# EAGLE design MegaMini (EAGLE 8.4.1)
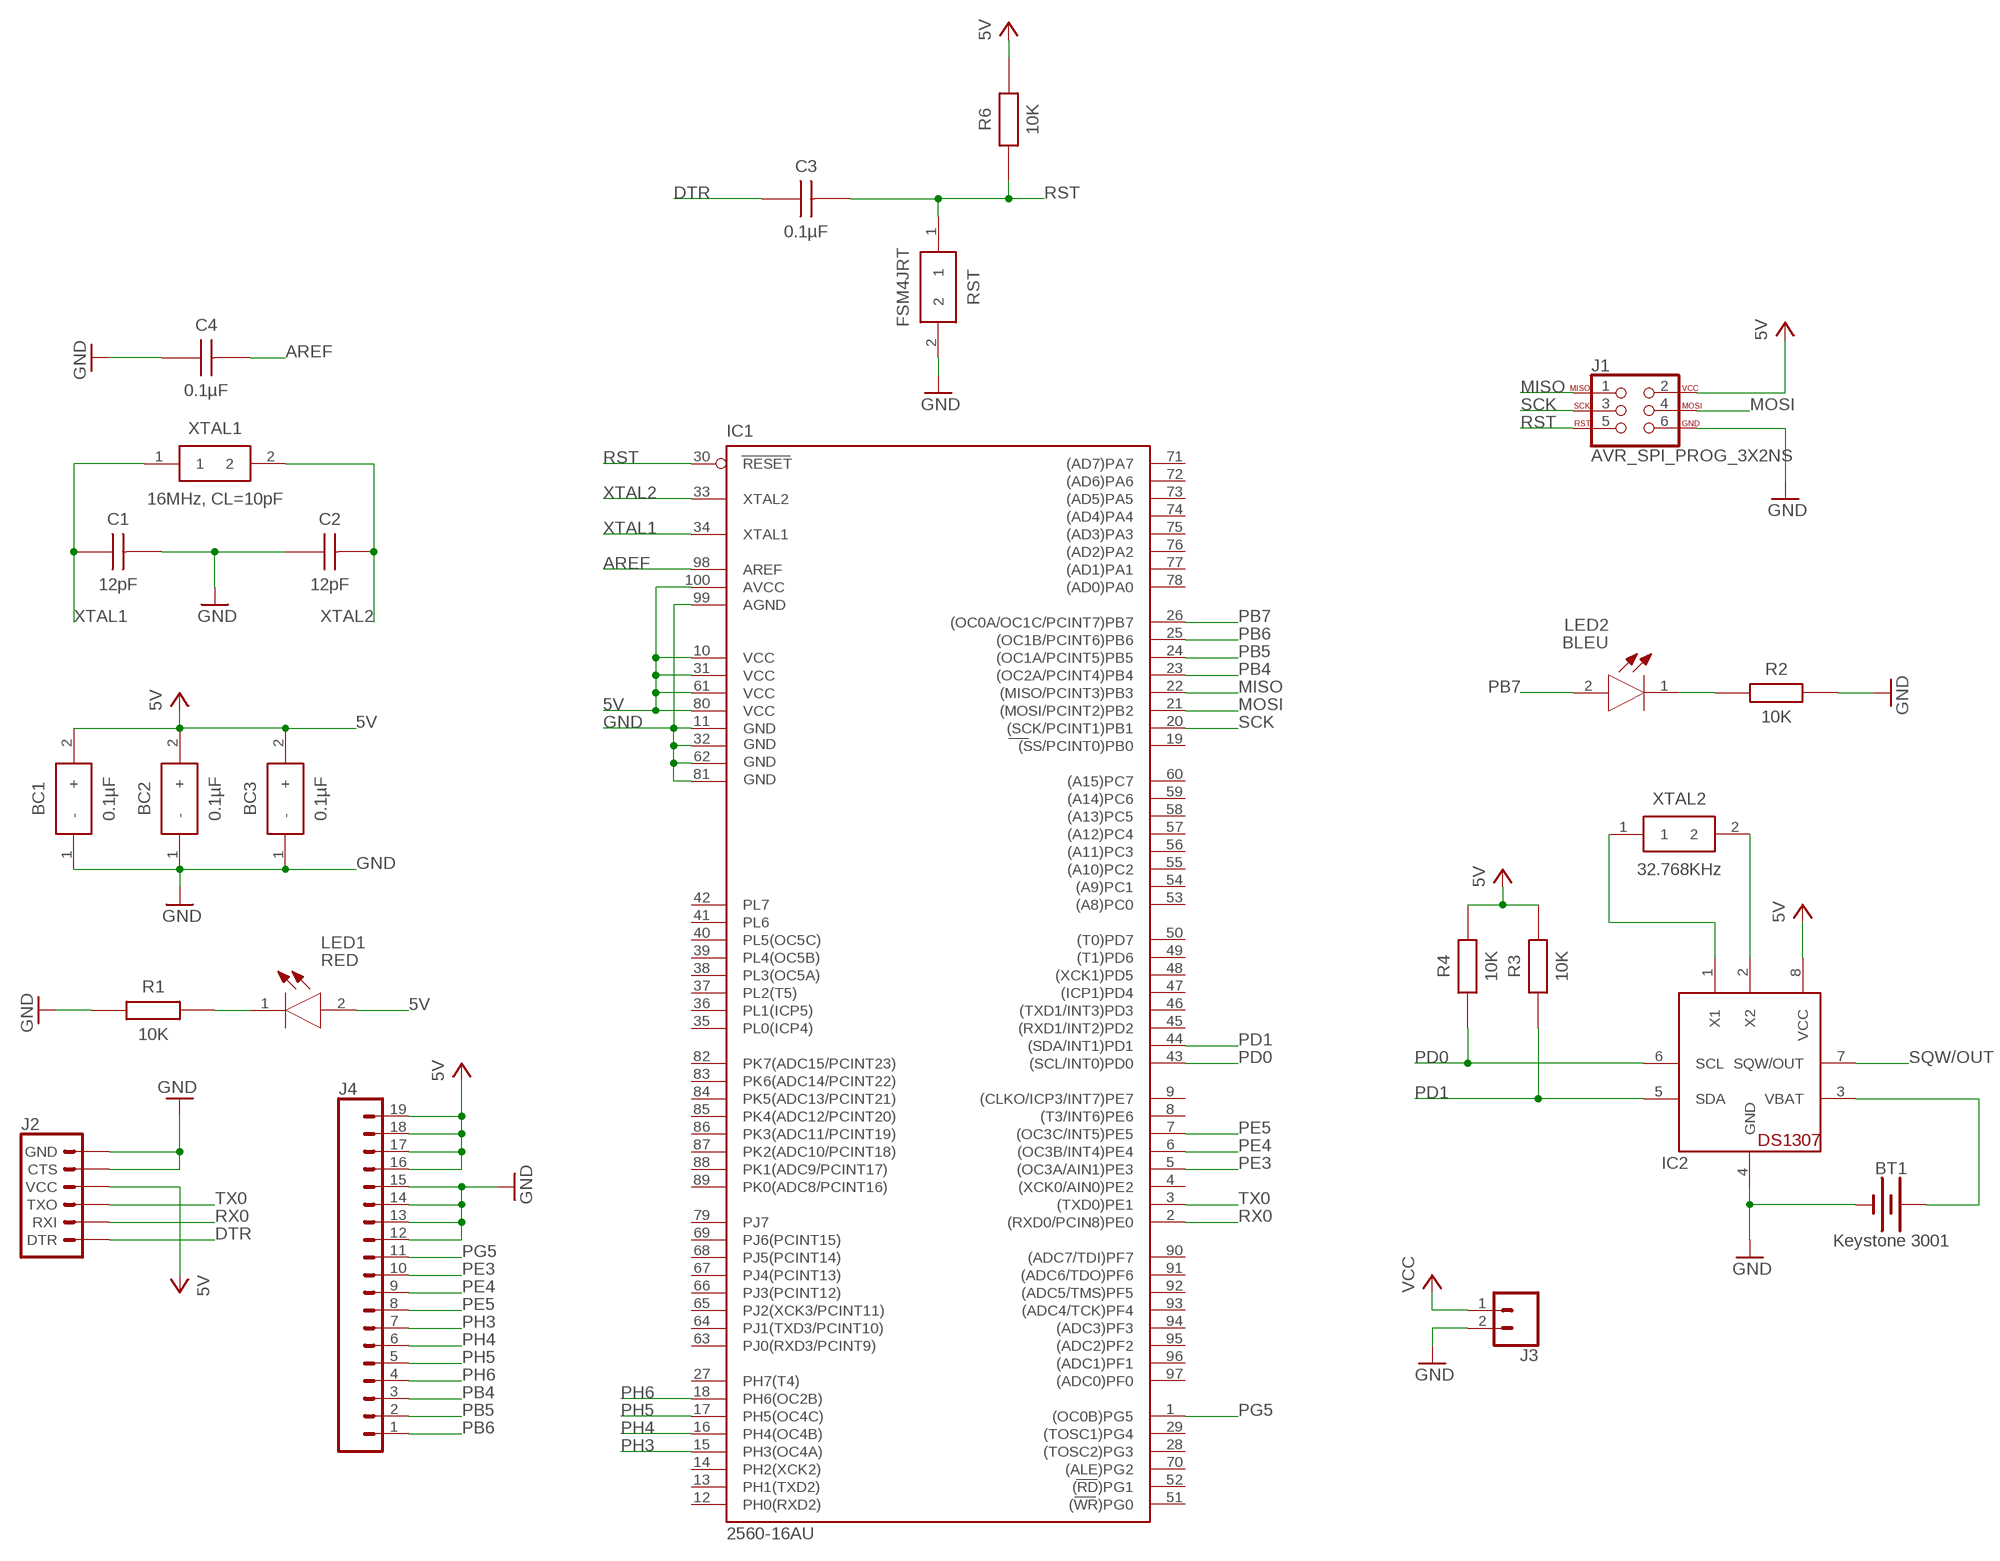
[diagram p0: schematic, sheet 1]

## Parts
BC1  0.1µF  865230640001  [865230640001]
BC2  0.1µF  865230640001  [865230640001]
BC3  0.1µF  865230640001  [865230640001]
BT1  Keystone 3001  BATTERY-12MM_PTH  [BATTCON_12MM_PTH]
C1  12pF  C1206C120J5GACTU  [CAPC3216X88N]
C2  12pF  C1206C120J5GACTU  [CAPC3216X88N]
C3  0.1µF  MC1206B104K500CT  [CAPC3216X90N]
C4  0.1µF  MC1206B104K500CT  [CAPC3216X90N]
IC1  2560-16AU  ATMEGA2560-16AU  [TQFP100]
IC2  DS1307  [DIL08]
J1  AVR_SPI_PROG_3X2NS  [2X3-NS]
J2  6_PIN_SERIAL_TARGET  [1X06]
J3  CONN_02  [1X02]
J4  CONN_19  [1X19]
LED1  RED  150060RS75000  [LEDC1608X80N]
LED2  BLEU  150120BS75000  [LEDC3214X78N]
R1  10K  ERJ-8ENF1002V  [RESC3116X70N]
R2  10K  ERJ-8ENF1002V  [RESC3116X70N]
R3  10K  ERJ-8ENF1002V  [RESC3116X70N]
R4  10K  ERJ-8ENF1002V  [RESC3116X70N]
R6  10K  ERJ-8ENF1002V  [RESC3116X70N]
RST  FSM4JRT  [FSM4JRT]
XTAL1  16MHz, CL=10pF  FOXSDLF_160-20  [FOXSDLF/120-20]
XTAL2  32.768KHz  Q13FC13500004_FC-135_32.768KHZ  [FC-135]

## Nets
5V: BC1.2(+) BC2.2(+) BC3.2(+) IC1.10(VCC) IC1.31(VCC1) IC1.61(VCC2) IC1.80(VCC3) IC1.100(AVCC) LED1.2(A)
AREF: C4.2 IC1.98(AREF)
DTR: C3.1 J2.1(DTR)
GND: BC1.1(-) BC2.1(-) BC3.1(-) BT1.GND(-) C1.2 C2.1 C4.1 IC1.11(GND) IC1.32(GND1) IC1.62(GND2) IC1.81(GND3) IC1.99(AGND) IC2.4(GND) J1.6 J2.5(CTS) J2.6(GND) J3.2 J4.12 J4.13 J4.14 J4.15 R1.1 R2.1 RST.2
MISO: IC1.22((MISO/PCINT3)PB3) J1.1
MOSI: IC1.21((MOSI/PCINT2)PB2) J1.4
N$1: LED1.1(K) R1.2
N$2: LED2.1(K) R2.2
N$3: IC2.1(X1) XTAL2.1
N$4: IC2.2(X2) XTAL2.2
N$5: BT1.VCC@1(+) IC2.3(VBAT)
PB4: IC1.23((OC2A/PCINT4)PB4) J4.3
PB5: IC1.24((OC1A/PCINT5)PB5) J4.2
PB6: IC1.25((OC1B/PCINT6)PB6) J4.1
PB7: IC1.26((OC0A/OC1C/PCINT7)PB7) LED2.2(A)
PD0: IC1.43((SCL/INT0)PD0) IC2.6(SCL) R4.1
PD1: IC1.44((SDA/INT1)PD1) IC2.5(SDA) R3.1
PE3: IC1.5((OC3A/AIN1)PE3) J4.10
PE4: IC1.6((OC3B/INT4)PE4) J4.9
PE5: IC1.7((OC3C/INT5)PE5) J4.8
PG5: IC1.1((OC0B)PG5) J4.11
PH3: IC1.15(PH3(OC4A)) J4.7
PH4: IC1.16(PH4(OC4B)) J4.6
PH5: IC1.17(PH5(OC4C)) J4.5
PH6: IC1.18(PH6(OC2B)) J4.4
RST: C3.2 IC1.30(RESET) J1.5 R6.1 RST.1
RX0: IC1.2((RXD0/PCIN8)PE0) J2.2(RXI)
SCK: IC1.20((SCK/PCINT1)PB1) J1.3
SQW/OUT: IC2.7(SQW/OUT)
TX0: IC1.3((TXD0)PE1) J2.3(TXO)
VCC: IC2.8(VCC) J1.2 J2.4(VCC) J3.1 J4.16 J4.17 J4.18 J4.19 R3.2 R4.2 R6.2 ; supply symbol labelled 5V
XTAL1: C1.1 IC1.34(XTAL1) XTAL1.1
XTAL2: C2.2 IC1.33(XTAL2) XTAL1.2
Unconnected: IC1.4((XCK0/AIN0)PE2) IC1.8((T3/INT6)PE6) IC1.9((CLKO/ICP3/INT7)PE7) IC1.12(PH0(RXD2)) IC1.13(PH1(TXD2)) IC1.14(PH2(XCK2)) IC1.19((SS/PCINT0)PB0) IC1.27(PH7(T4)) IC1.28((TOSC2)PG3) IC1.29((TOSC1)PG4) IC1.35(PL0(ICP4)) IC1.36(PL1(ICP5)) IC1.37(PL2(T5)) IC1.38(PL3(OC5A)) IC1.39(PL4(OC5B)) IC1.40(PL5(OC5C)) IC1.41(PL6) IC1.42(PL7) IC1.45((RXD1/INT2)PD2) IC1.46((TXD1/INT3)PD3) IC1.47((ICP1)PD4) IC1.48((XCK1)PD5) IC1.49((T1)PD6) IC1.50((T0)PD7) IC1.51((WR)PG0) IC1.52((RD)PG1) IC1.53((A8)PC0) IC1.54((A9)PC1) IC1.55((A10)PC2) IC1.56((A11)PC3) IC1.57((A12)PC4) IC1.58((A13)PC5) IC1.59((A14)PC6) IC1.60((A15)PC7) IC1.63(PJ0(RXD3/PCINT9)) IC1.64(PJ1(TXD3/PCINT10)) IC1.65(PJ2(XCK3/PCINT11)) IC1.66(PJ3(PCINT12)) IC1.67(PJ4(PCINT13)) IC1.68(PJ5(PCINT14)) IC1.69(PJ6(PCINT15)) IC1.70((ALE)PG2) IC1.71((AD7)PA7) IC1.72((AD6)PA6) IC1.73((AD5)PA5) IC1.74((AD4)PA4) IC1.75((AD3)PA3) IC1.76((AD2)PA2) IC1.77((AD1)PA1) IC1.78((AD0)PA0) IC1.79(PJ7) IC1.82(PK7(ADC15/PCINT23)) IC1.83(PK6(ADC14/PCINT22)) IC1.84(PK5(ADC13/PCINT21)) IC1.85(PK4(ADC12/PCINT20)) IC1.86(PK3(ADC11/PCINT19)) IC1.87(PK2(ADC10/PCINT18)) IC1.88(PK1(ADC9/PCINT17)) IC1.89(PK0(ADC8/PCINT16)) IC1.90((ADC7/TDI)PF7) IC1.91((ADC6/TDO)PF6) IC1.92((ADC5/TMS)PF5) IC1.93((ADC4/TCK)PF4) IC1.94((ADC3)PF3) IC1.95((ADC2)PF2) IC1.96((ADC1)PF1) IC1.97((ADC0)PF0)

## Library data of the parts
BC1-BC3 = C_WCAP-AS5H Series:865230640001: Wurth Elektronik 100nF 50 V dc Aluminium Electrolytic Capacitor, WCAP-AS5H Series 5000h 5.5 (Dia.) x 3.85mm <https://componentsearchengine.com/Images/3/865230640001.jpg> Source: Datasheet <http://uk.rs-online.com/webdocs/135a/0900766b8135a640.pdf>; DESCRIPTION: Wurth Elektronik 100nF 50 V dc Aluminium Electrolytic Capacitor, WCAP-AS5H Series 5000h 5.5 (Dia.) x 3.85mm; HEIGHT: mm; MANUFACTURER_NAME: W&uuml;rth Elektronik; MANUFACTURER_PART_NUMBER: 865230640001; RS_PART_NUMBER: 8387838P; SUPPLIER_NAME: RS
BT1 = SparkFun-Batteries:BATTERY: Battery - Single Cell A variety of battery chemistries, sizes, and footprints. Device List: 20MM_PTH - Coin Cell Battery Holder - 20mm (PTH) <https://www.sparkfun.com/products/783> 6.8MM_PTH - Coin Cell Battery Holder - 6.8MM(SMD) <https://www.digikey.com/product-detail/en/seiko-instruments/MS621FE-FL11E/728-1057-ND/1889208?WT.srch=1&gclid=CNOQ5a6LzdQCFZS2wAodXCkE0g> 12MM_SMD - Coin Cell Battery Holder - 12mm (SMD) <https://www.sparkfun.com/products/10592> 12MM_PTH - Coin Cell Battery Holder - 12mm (PTH) <https://www.sparkfun.com/products/7948> 20MM_SMD - 20mm Coin Cell Battery Holder (SMD) (2 legs) Used on the Big Time Watch Kit <https://www.sparkfun.com/products/11734> 20MM_SMD_4LEGS - Coin Cell Battery Holder - 20mm (SMD) <https://www.sparkfun.com/products/11892> 20MM_SMD_4LEGS_OVERPASTE - Coin Cell Battery Holder - 20mm (SMD) <https://www.sparkfun.com/products/11892> (Over-paste on the legs) 24.5MM_PTH - Coin Cell Battery Holder - 24.5mm (PTH) <https://www.sparkfun.com/products/8863> 9V - 9V Battery Holder - PC Mount Used on the SparkFun SparkPunk Sound Kit <https://www.sparkfun.com/products/11177> and SparkFun SparkPunk Sequencer Kit <https://www.sparkfun.com/products/12707> 18650 - Battery Holder - 18650 (PTH) <https://www.sparkfun.com/products/13113> AA - Battery Holder - 1xAA (PTH) <https://www.sparkfun.com/products/7949> AAA - Battery Holder - 1xAAA (PTH) <https://www.sparkfun.com/products/12718> AA_KIT - Battery Holder - 1xAA (PTH) <https://www.sparkfun.com/products/7949> Special kit package - pads only have exposed copper on one side of the board. AAA_KIT - Battery Holder - 1xAAA (PTH) <https://www.sparkfun.com/products/12718> Special kit package - pads only have exposed copper on one side of the board.; PROD_ID: BATT-08315; SF_SKU: PRT-07948
C1 C2 = C_C1206C120J5GACTU:C1206C120J5GACTU: Kemet 1206 C 12pF Ceramic Multilayer Capacitor, 50 V, +125C, C0G Dielectric, 5% <https://componentsearchengine.com/Images/3/C1206C120J5GACTU.jpg> Source: Datasheet <http://uk.rs-online.com/webdocs/1526/0900766b81526086.pdf>; DESCRIPTION: Kemet 1206 C 12pF Ceramic Multilayer Capacitor, 50 V, +125C, C0G Dielectric, 5%; HEIGHT: 0.88mm; MANUFACTURER_NAME: Kemet; MANUFACTURER_PART_NUMBER: C1206C120J5GACTU; RS_PART_NUMBER: 8029986P; SUPPLIER_NAME: RS
C3 C4 = C_MC1206B104K500CT:MC1206B104K500CT: MULTICOMP - MC1206B104K500CT - CAP, MLCC, X7R, 100NF, 50V, 1206 Source: Datasheet <http://www.farnell.com/datasheets/1901289.pdf>; DESCRIPTION: MULTICOMP - MC1206B104K500CT - CAP, MLCC, X7R, 100NF, 50V, 1206; HEIGHT: 0.9mm; MANUFACTURER_NAME: MULTICOMP; MANUFACTURER_PART_NUMBER: MC1206B104K500CT; SUPPLIER_NAME: RS
IC1 = atmel-2005:ATMEGA*: MICROCONTROLLER 64/128/256 Kbytes FLASH 4 Kbytes EEPROM 8 Kbytes SRAM 86 General Purpose I/O pins 12-channels16-bit PWM 4 x Serial USARTs 16-channels 10-bit A/D
IC2 = adafruit:DS1307: DS1307 Real time clock (RTC) with battery backup ability. Talk to it via i2c
J1 = SparkFun-Connectors:AVR_SPI_PROG_3X2: AVR ISP 6 Pin This is the reduced ISP connector for AVR programming. Common on Arduino. This footprint will take up less PCB space and can be used with a 10-pin to 6-pin adapter such as SKU: BOB-08508 **Special note about "TEST_POINT" package. The stop mask is on the top side, so if you want your programming test points to be on the bottom of your board, make sure to place this package on the bottom side of the board. This also ensure that the orientation to program from the bottom side will be correct. SparkFun Products: SparkFun ISP Pogo Adapter <https://www.sparkfun.com/products/11591> - NS Tiny AVR Programmer <https://www.sparkfun.com/products/11801> -PTH
J2 = SparkFun-Connectors:6_PIN_SERIAL_TARGET: 6-pin header connection for use with the "FTDI BASIC" pinout - TARGET SIDE. Also known as "Arduino Serial Program Header". It is used to mate with our FTDI Basic serial programmers using the Arduino IDE. Note, this device has "TARGET" in the name. It is intended to be used on a design that contains a target micro-controller that you wish to program. The "sister" device, named "CABLE" is inteneded to be used on a design that usually lives on the end of your USB cable and prvides the converter chip (FTDI232 or FTDI231x) to commnicate serial RX/TX. You can populate with some of these: Break Away Headers - Straight <https://www.sparkfun.com/products/116> (PRT-00116) For reference (or to suit your programming needs) check out these designs: SparkFun FTDI Basic Breakout - 5V <https://www.sparkfun.com/products/9716> (DEV-09716) SparkFun FTDI Basic Breakout - 3.3V <https://www.sparkfun.com/products/9873> (DEV-09873) SparkFun FTDI SmartBasic <https://www.sparkfun.com/products/12935> (DEV-12935) SparkFun Beefy 3 - FTDI Basic Breakout <https://www.sparkfun.com/products/13746> (DEV-13746)
J3 = SparkFun-Connectors:CONN_02: Multi connection point. Often used as Generic Header-pin footprint for 0.1 inch spaced/style header connections On any of the 0.1 inch spaced packages, you can populate with these: Break Away Headers - Straight <https://www.sparkfun.com/products/116> (PRT-00116) Break Away Male Headers - Right Angle <https://www.sparkfun.com/products/553> (PRT-00553) Female Headers <https://www.sparkfun.com/products/115> (PRT-00115) Break Away Headers - Machine Pin <https://www.sparkfun.com/products/117> (PRT-00117) Break Away Female Headers - Swiss Machine Pin <https://www.sparkfun.com/products/743> (PRT-00743) For SCREWTERMINALS and SPRING TERMINALS visit here: Screw Terimnals on SparkFun.com <https://www.sparkfun.com/search/results?term=Screw+Terminals> (5mm/3.5mm/2.54mm spacing) This device is also useful as a general connection point to wire up your design to another part of your project. Our various solder wires solder well into these plated through hole pads. Hook-Up Wire - Assortment (Stranded, 22 AWG) <https://www.sparkfun.com/products/11375> (PRT-11375) Hook-Up Wire - Assortment (Solid Core, 22 AWG) <https://www.sparkfun.com/products/11367> (PRT-11367) View the entire wire category on our website here <https://www.sparkfun.com/categories/141> Special notes: Molex polarized connector foot print use with: PRT-08233 with associated crimp pins and housings. 2.54_SCREWTERM for use with PRT-10571. 3.5mm Screw Terminal footprints for PRT-08084 5mm Screw Terminal footprints for use with PRT-08432
J4 = SparkFun-Connectors:CONN_19: Multi connection point. Often used as Generic Header-pin footprint for 0.1 inch spaced/style header connections On any of the 0.1 inch spaced packages, you can populate with these: Break Away Headers - Straight <https://www.sparkfun.com/products/116> (PRT-00116) Break Away Male Headers - Right Angle <https://www.sparkfun.com/products/553> (PRT-00553) Female Headers <https://www.sparkfun.com/products/115> (PRT-00115) Break Away Headers - Machine Pin <https://www.sparkfun.com/products/117> (PRT-00117) Break Away Female Headers - Swiss Machine Pin <https://www.sparkfun.com/products/743> (PRT-00743) For SCREWTERMINALS and SPRING TERMINALS visit here: Screw Terimnals on SparkFun.com <https://www.sparkfun.com/search/results?term=Screw+Terminals> (5mm/3.5mm/2.54mm spacing) This device is also useful as a general connection point to wire up your design to another part of your project. Our various solder wires solder well into these plated through hole pads. Hook-Up Wire - Assortment (Stranded, 22 AWG) <https://www.sparkfun.com/products/11375> (PRT-11375) Hook-Up Wire - Assortment (Solid Core, 22 AWG) <https://www.sparkfun.com/products/11367> (PRT-11367) View the entire wire category on our website here <https://www.sparkfun.com/categories/141> Special notes: Molex polarized connector foot print use with SKU : PRT-08231 with associated crimp pins and housings. 1MM SMD Version SKU: PRT-10208 NOTES ON THE VARIANTS LOCK and LOCK_LONGPADS... This footprint was designed to help hold the alignment of a through-hole component (i.e. 6-pin header) while soldering it into place. You may notice that each hole has been shifted either up or down by 0.005 of an inch from it's more standard position (which is a perfectly straight line). This slight alteration caused the pins (the squares in the middle) to touch the edges of the holes. Because they are alternating, it causes a "brace" to hold the component in place. 0.005 has proven to be the perfect amount of "off-center" position when using our standard breakaway headers. Although looks a little odd when you look at the bare footprint, once you have a header in there, the alteration is very hard to notice. Also,if you push a header all the way into place, it is covered up entirely on the bottom side.
LED1 = C_150060RS75000:150060RS75000: WURTH ELEKTRONIK - 150060RS75000 - LED, 0603, RED, 250MCD, 625NM <https://componentsearchengine.com/Images/1/150060RS75000.JPG> Source: Datasheet <http://katalog.we-online.de/led/datasheet/150060RS75000.pdf>; DESCRIPTION: WURTH ELEKTRONIK - 150060RS75000 - LED, 0603, RED, 250MCD, 625NM; HEIGHT: 0.8mm; MANUFACTURER_NAME: W&uuml;rth Elektronik; MANUFACTURER_PART_NUMBER: 150060RS75000; SUPPLIER_NAME: RS
LED2 = C_150120BS75000:150120BS75000: LED,Wurth Elektronik,150120BS75000 Wurth Elektronik 150120BS75000, WL-SMCW Series Blue LED, 470 nm, 3016 (1206) Clear, Rectangle Lens SMD Package <https://componentsearchengine.com/Images/3/150120BS75000.jpg> Source: Datasheet <http://docs-europe.electrocomponents.com/webdocs/1302/0900766b81302e27.pdf>; DESCRIPTION: LED,Wurth Elektronik,150120BS75000 Wurth Elektronik 150120BS75000, WL-SMCW Series Blue LED, 470 nm, 3016 (1206) Clear, Rectangle Lens SMD Package; HEIGHT: 0.78mm; MANUFACTURER_NAME: W&uuml;rth Elektronik; MANUFACTURER_PART_NUMBER: 150120BS75000; RS_PART_NUMBER: 8154243; SUPPLIER_NAME: RS
R1-R4 R6 = C_ERJ8ENF1002V:ERJ-8ENF1002V: Thick Film Resistors - SMD 1206 10Kohms 1% Tol <https://componentsearchengine.com/Images/1/ERJ-8ENF1002V.jpg> Source: Datasheet <https://industrial.panasonic.com/cdbs/www-data/pdf/RDA0000/AOA0000C86.pdf>; DESCRIPTION: Thick Film Resistors - SMD 1206 10Kohms 1% Tol; HEIGHT: 0.7mm; MANUFACTURER_NAME: Panasonic; MANUFACTURER_PART_NUMBER: ERJ-8ENF1002V; SUPPLIER_NAME: RS
RST = C_FSM4JRT:FSM4JRT: Tactile switch,PCB,SPST,raised actuator Black Button Tactile Switch, SPST 50 mA@ 24 V dc 1.4mm <https://componentsearchengine.com/Images/3/FSM4JRT.jpg> Source: Datasheet <http://www.mouser.com/ds/2/418/NG_CD_2-1437565-2_P5-663780.pdf>; DESCRIPTION: Tactile switch,PCB,SPST,raised actuator Black Button Tactile Switch, SPST 50 mA@ 24 V dc 1.4mm; HEIGHT: mm; MANUFACTURER_NAME: TE Connectivity; MANUFACTURER_PART_NUMBER: FSM4JRT; RS_PART_NUMBER: 7182415P; SUPPLIER_NAME: RS
XTAL1 = C_FOXSDLF_160-20:FOXSDLF_160-20: Crystal SMD 16.000MHz HC49S-SMD Crystal 16MHz, 30ppm, 2-Pin SMD, 11.7 x 5 x 4.5mm <https://componentsearchengine.com/Images/3/FOXSDLF_160-20.jpg> Source: Datasheet <http://www.mouser.com/ds/2/160/C4SD-1131563.pdf>; DESCRIPTION: Crystal SMD 16.000MHz HC49S-SMD Crystal 16MHz, 30ppm, 2-Pin SMD, 11.7 x 5 x 4.5mm; HEIGHT: mm; MANUFACTURER_NAME: FOX ELECTRONICS; MANUFACTURER_PART_NUMBER: FOXSDLF/160-20; RS_PART_NUMBER: 5476531; SUPPLIER_NAME: RS
XTAL2 = C_Q13FC13500004_FC-135_32.768KHZ:Q13FC13500004_FC-135_32.768KHZ: kHz Range Crystal Unit Source: Datasheet <https://support.epson.biz/td/api/doc_check.php?mode=dl&lang=en&Parts=FC-135.pdf>; DESCRIPTION: kHz Range Crystal Unit; HEIGHT: mm; MANUFACTURER_NAME: EPSON; MANUFACTURER_PART_NUMBER: Q13FC13500004 FC-135 32.768KHZ 12.5PF; SUPPLIER_NAME: RS

## Board
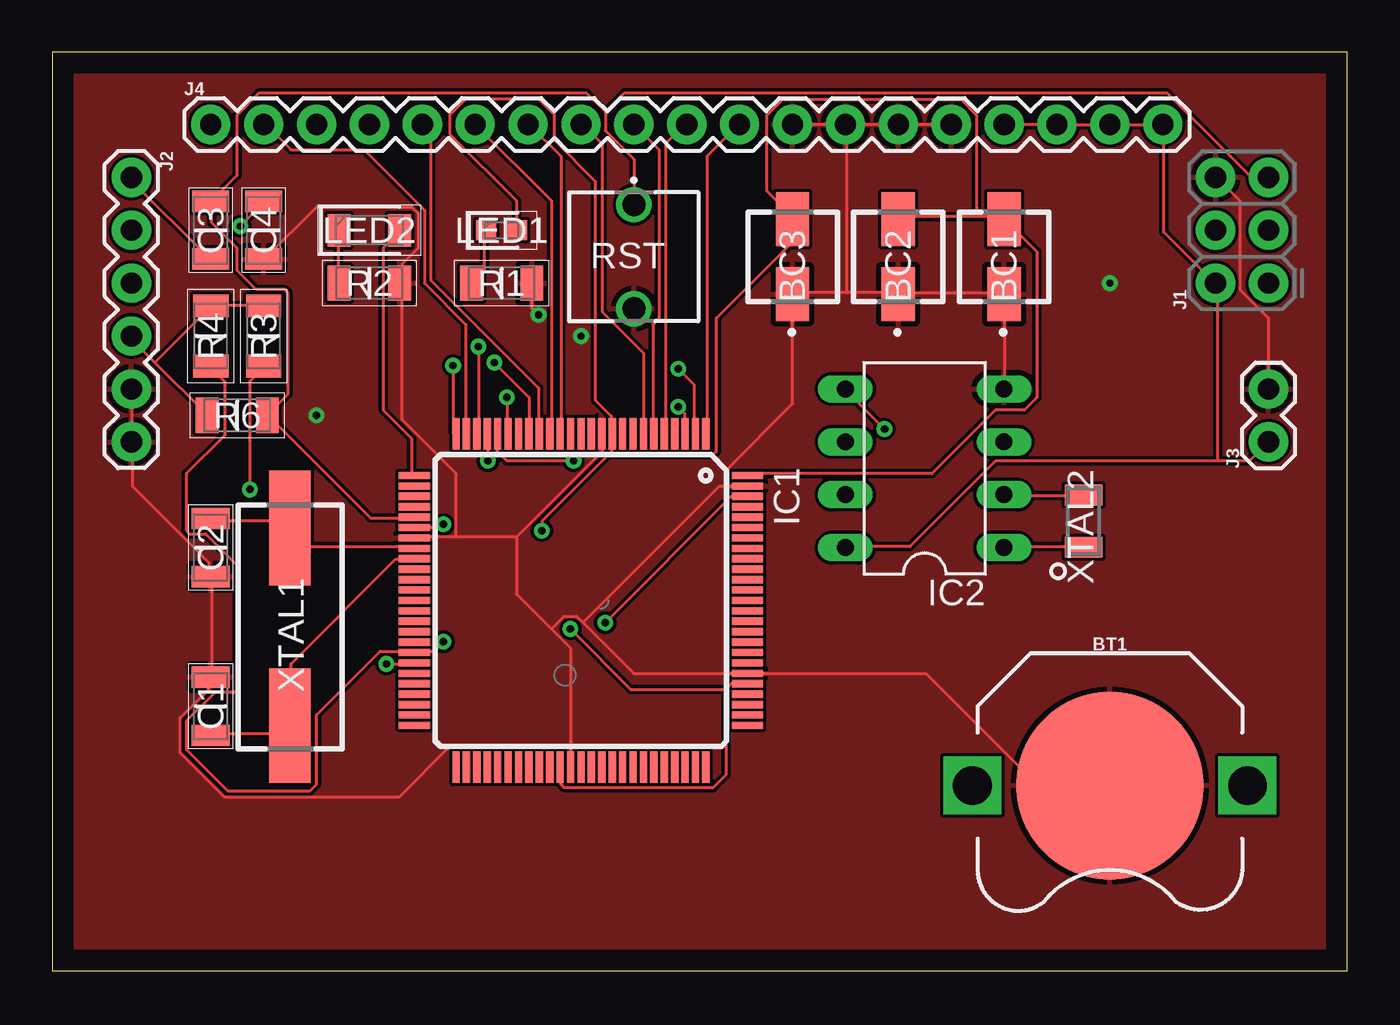
[diagram p1: board, top side]
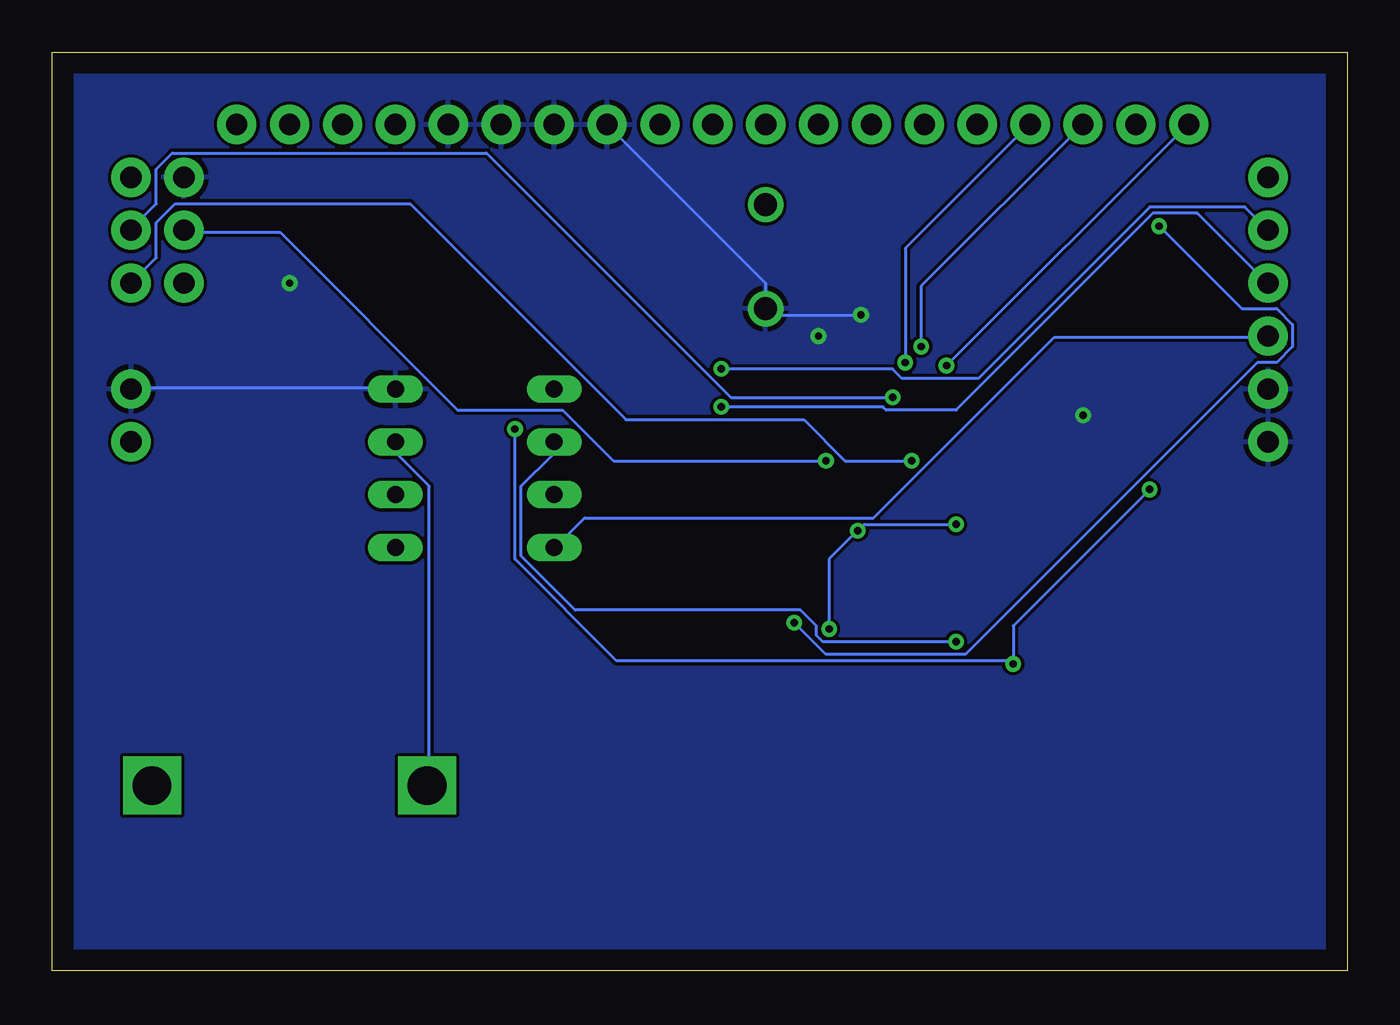
[diagram p2: board, bottom side, seen from below]

Size 62.21 x 44.12 mm. Coordinates in mm from the lower left corner, seen from the top.
Outline: 0,0 62.21,0 62.21,44.12 0,44.12 0,0
Copper layers (1*16): Top 0.035mm / dielectric 1.5mm / Bottom 0.035mm
Design rules "default": minimum track width 6mil, minimum drill 0.35mm, track to track 6mil, track to pad 6mil, pad to pad 6mil, via to via 6mil, smd to smd 6mil, copper to edge 40mil, drill to drill 6mil, minimum pad ring 10mil, minimum via ring 8mil, stop-mask expansion 4mil, vias tented up to drill 0mil, thermal gap 10mil

### Footprints (pad centres in the part's own frame; a part is rotated, then mirrored left to right if it is on the bottom)
865230640001 = smd 2.6 x 1.6: 1 -1.8,0; 2 1.8,0
BATTCON_12MM_PTH = smd 9 x 9: GND 0,0 | drill 1.854 square: VCC@1 6.604,0; VCC@2 -6.604,0
CAPC3216X88N = smd 1.02 x 1.82: 1 -1.4,0; 2 1.4,0
CAPC3216X90N = smd 1.03 x 1.78: 1 -1.38,0; 2 1.38,0
TQFP100 = smd 1.5 x 0.35: 1 -8,6; 2 -8,5.5; 3 -8,5; 4 -8,4.5; 5 -8,4; 6 -8,3.5; 7 -8,3; 8 -8,2.5; 9 -8,2; 10 -8,1.5; 11 -8,1; 12 -8,0.5; 13 -8,0; 14 -8,-0.5; 15 -8,-1; 16 -8,-1.5; 17 -8,-2; 18 -8,-2.5; 19 -8,-3; 20 -8,-3.5; 21 -8,-4; 22 -8,-4.5; 23 -8,-5; 24 -8,-5.5; 25 -8,-6; 51 8,-6; 52 8,-5.5; 53 8,-5; 54 8,-4.5; 55 8,-4; 56 8,-3.5; 57 8,-3; 58 8,-2.5; 59 8,-2; 60 8,-1.5; 61 8,-1; 62 8,-0.5; 63 8,0; 64 8,0.5; 65 8,1; 66 8,1.5; 67 8,2; 68 8,2.5; 69 8,3; 70 8,3.5; 71 8,4; 72 8,4.5; 73 8,5; 74 8,5.5; 75 8,6 | smd 0.35 x 1.5: 26 -6,-8; 27 -5.5,-8; 28 -5,-8; 29 -4.5,-8; 30 -4,-8; 31 -3.5,-8; 32 -3,-8; 33 -2.5,-8; 34 -2,-8; 35 -1.5,-8; 36 -1,-8; 37 -0.5,-8; 38 0,-8; 39 0.5,-8; 40 1,-8; 41 1.5,-8; 42 2,-8; 43 2.5,-8; 44 3,-8; 45 3.5,-8; 46 4,-8; 47 4.5,-8; 48 5,-8; 49 5.5,-8; 50 6,-8; 76 6,8; 77 5.5,8; 78 5,8; 79 4.5,8; 80 4,8; 81 3.5,8; 82 3,8; 83 2.5,8; 84 2,8; 85 1.5,8; 86 1,8; 87 0.5,8; 88 0,8; 89 -0.5,8; 90 -1,8; 91 -1.5,8; 92 -2,8; 93 -2.5,8; 94 -3,8; 95 -3.5,8; 96 -4,8; 97 -4.5,8; 98 -5,8; 99 -5.5,8; 100 -6,8
DIL08 = drill 0.813 long: 1 -3.81,-3.81; 2 -1.27,-3.81; 3 1.27,-3.81; 4 3.81,-3.81; 5 3.81,3.81; 6 1.27,3.81; 7 -1.27,3.81; 8 -3.81,3.81
2X3-NS = drill 1.016 pad 1.88: 1 -2.54,-1.27; 2 -2.54,1.27; 3 0,-1.27; 4 0,1.27; 5 2.54,-1.27; 6 2.54,1.27
1X06 = drill 1.016 pad 1.88: 1 0,0; 2 2.54,0; 3 5.08,0; 4 7.62,0; 5 10.16,0; 6 12.7,0
1X02 = drill 1.016 pad 1.88: 1 0,0; 2 2.54,0
1X19 = drill 1.016 pad 1.88: 1 0,0; 2 2.54,0; 3 5.08,0; 4 7.62,0; 5 10.16,0; 6 12.7,0; 7 15.24,0; 8 17.78,0; 9 20.32,0; 10 22.86,0; 11 25.4,0; 12 27.94,0; 13 30.48,0; 14 33.02,0; 15 35.56,0; 16 38.1,0; 17 40.64,0; 18 43.18,0; 19 45.72,0
LEDC1608X80N = smd 0.95 x 0.95: 1 -0.75,0; 2 0.75,0
LEDC3214X78N = smd 1.1 x 1.55: 1 -1.45,0; 2 1.45,0
RESC3116X70N = smd 1.1 x 1.7: 1 -1.45,0; 2 1.45,0
FSM4JRT = drill 1.1 pad 1.7: 1 0,2.5; 2 0,-2.5
FOXSDLF/120-20 = smd 5.5 x 2: 1 -4.75,0; 2 4.75,0
FC-135 = smd 1 x 1.8: 1 -1.25,0; 2 1.25,0

### Placement (x,y rotation side)
BC1  45.72,34.29 90 top
BC2  40.64,34.29 90 top
BC3  35.56,34.29 90 top
BT1  50.8,8.89 180 top
C1  7.62,12.7 90 top
C2  7.62,20.32 90 top
C3  7.62,35.56 90 top
C4  10.16,35.56 90 top
IC1  25.4,17.78 270 top
IC2  41.91,24.13 90 top
J1  57.15,35.56 90 top
J2  3.81,38.1 270 top
J3  58.42,25.4 90 top
J4  7.62,40.64 0 top
LED1  21.59,35.56 0 top
LED2  15.24,35.56 0 top
R1  21.59,33.02 180 top
R2  15.24,33.02 180 top
R3  10.16,30.48 90 top
R4  7.62,30.48 90 top
R6  8.89,26.67 180 top
RST  27.94,34.29 0 top
XTAL1  11.43,16.51 90 top
XTAL2  49.53,21.59 90 top

### Tracks (layer width: path | path; a pad name or v marks a point on that pad's centre or on a via)
5V  (via drill 0.35)
  Top 0.152: IC1.100 33.43,23.88 42.27,23.88 45.31,26.92 46.69,26.92 47.3,27.53 47.3,34.54 45.77,36.07 BC1.2 45.62,36.22 44.4,36.22 | 44.4,36.22 40.74,36.22 BC2.2 | 32.36,13.51 32.36,9.4 31.75,8.79 24.59,8.79 24.43,8.94 24.43,9.7 IC1.61 | 32.36,13.51 32.66,13.82 33.27,13.82 IC1.80 | LED1.2 22.3,35.61 22.3,36.98 19.1,40.18 19.1,41.1 19.86,41.86 23.37,41.86 24.13,41.1 24.13,39.88 26.11,37.9 26.11,27.38 26.87,26.62 26.87,25.86 IC1.10 26.87,25.7 26.87,24.94 26.72,24.79 | v18.8,21.44 18.64,21.29 17.42,21.29 IC1.31 | v23.52,21.13 23.52,21.59 26.72,24.79 | 26.72,24.79 31.75,24.79 31.9,24.94 31.9,31.34 35.56,35 BC3.2 35.56,36.22 34.34,37.44 34.34,41.1 35.1,41.86 43.64,41.86 44.4,41.1 44.4,36.22 | 32.36,13.51 27.79,13.51 v24.89,16.41
  Bottom 0.152: v18.8,21.44 23.22,21.44 v23.52,21.13 24.89,19.76 v24.89,16.41
AREF  (via drill 0.35)
  Top 0.152: v26.57,16.71 32.66,22.81 33.27,22.81 IC1.98 | v9.04,35.76 10.11,36.83 C4.2
  Bottom 0.152: v26.57,16.71 25.04,15.19 18.34,15.19 4.32,29.21 3.4,29.21 2.64,29.97 2.64,31.04 3.4,31.8 5.08,31.8 v9.04,35.76
DTR
  Top 0.152: C3.1 7.52,34.24 3.71,38.05 J2.1
GND  (via drill 0.35)
  Top 0.152: J3.2 58.42,31.34 57.05,32.72 57.05,36.98 55.98,38.05 J1.6 | IC2.4 45.77,27.99 45.77,32.41 BC1.1 45.62,32.56 40.74,32.56 BC2.1 40.59,32.56 38.15,32.56 | 38.15,32.56 35.56,32.56 BC3.1 35.56,27.23 32.36,24.03 32.36,23.27 | v23.37,31.5 23.06,31.8 23.06,33.02 R1.1 | J4.12 J4.13 38.15,40.64 | J4.15 J4.14 38.15,40.64 | 38.15,40.64 38.15,32.56 | 3.86,25.4 3.86,23.27 7.52,19.61 7.52,19 C2.1 7.67,18.85 7.67,14.12 C1.2 7.52,13.97 7.52,13.51 6.15,12.14 6.15,10.46 8.28,8.33 16.66,8.33 19.1,10.77 24.89,10.77 | 3.86,25.4 3.86,27.84 J2.5 | 3.86,25.4 J2.6 | 16.82,33.02 16.82,33.93 17.58,34.7 17.58,36.37 17.27,36.68 12.7,36.68 10.26,34.24 C4.1 | 22.3,20.83 19.41,20.83 | 19.41,20.83 17.42,20.83 IC1.32 | 22.3,20.83 26.42,24.94 26.42,25.7 IC1.11 | 24.89,10.77 24.89,15.49 23.98,16.41 | 24.89,10.77 24.89,9.86 IC1.62 | 23.98,16.41 22.3,18.09 22.3,20.83 | 25.5,16.71 25.2,17.02 24.59,17.02 23.98,16.41 | 25.5,16.71 27.94,14.28 33.27,14.28 IC1.81 33.43,14.28 41.96,14.28 47.3,8.94 50.8,8.94 BT1.GND | 32.36,23.27 32.05,23.27 25.5,16.71 | 32.36,23.27 33.27,23.27 IC1.99 | 16.82,33.02 16.82,26.47 19.41,23.88 19.41,20.83 | 16.82,33.02 R2.1
  Bottom 0.152: v23.37,31.5 27.79,31.5 27.94,31.65 RST.2 27.94,33.02 J4.12 | J3.2 58.42,27.99 45.77,27.99 IC2.4
  other vias: 50.8,33.02 12.7,26.67 25.4,30.48
  pour Top: 0,44.45 62.23,44.45 62.23,0 0,0
  pour Bottom: 0,44.45 62.23,44.45 62.23,0 0,0
MISO  (via drill 0.35)
  Top 0.152: v20.93,24.49 20.93,25.7 IC1.22
  Bottom 0.152: v20.93,24.49 24.13,24.49 26.11,26.47 34.65,26.47 45.01,36.83 56.29,36.83 57.2,35.92 57.2,34.24 J1.1
MOSI  (via drill 0.35)
  Top 0.152: v25.04,24.49 21.84,24.49 21.39,24.94 21.39,25.7 IC1.21
  Bottom 0.152: v25.04,24.49 35.26,24.49 37.69,26.92 42.72,26.92 51.26,35.46 55.83,35.46 J1.4
N$1
  Top 0.152: LED1.1 20.78,35.46 20.78,33.63 20.17,33.02 R1.2
N$2
  Top 0.152: LED2.1 13.77,35.46 13.77,33.02 R2.2
N$3
  Top 0.152: XTAL2.1 49.43,20.37 45.77,20.37 IC2.1
N$4
  Top 0.152: XTAL2.2 49.43,22.81 45.77,22.81 IC2.2
N$5
  Bottom 0.152: IC2.3 45.62,25.4 45.62,24.79 44.09,23.27 44.09,8.94 BT1.VCC@1
PB4  (via drill 0.35)
  Top 0.152: v20.47,29.97 20.47,25.86 IC1.23
  Bottom 0.152: v20.47,29.97 20.47,32.87 J4.3
PB5
  Top 0.152: IC1.24 19.86,25.86 19.86,31.04 17.88,33.02 17.88,36.52 14.99,39.42 11.48,39.42 10.26,40.64 J4.2
PB6  (via drill 0.35)
  Top 0.152: v19.25,29.06 19.25,25.86 IC1.25
  Bottom 0.152: v19.25,29.06 7.67,40.64 J4.1
PB7
  Top 0.152: IC1.26 17.27,23.88 17.27,25.55 15.9,26.92 15.9,34.7 16.66,35.46 LED2.2
PD0  (via drill 0.35)
  Top 0.152: R4.1 7.67,28.91 8.28,28.3 8.28,25.7 6.45,23.88 6.45,21.13 6.6,20.98 7.37,20.98 8.89,19.46 8.89,13.51 8.74,13.36 7.82,13.36 6.45,11.99 6.45,10.62 8.43,8.64 12.39,8.64 12.7,8.94 12.7,12.29 15.75,15.34 17.27,15.34 IC1.43 17.42,15.34 18.34,15.34 v18.8,15.8
  Bottom 0.152: v18.8,15.8 25.2,15.8 25.5,16.1 25.5,16.56 26.26,17.32 37.08,17.32 39.67,19.91 39.67,23.27 38.15,24.79 38.15,25.4 IC2.6
PD1  (via drill 0.35)
  Top 0.152: v16.05,14.73 17.27,14.73 IC1.44 | v9.5,23.11 9.5,28.3 10.11,28.91 R3.1 | v39.98,26.01 38.15,27.84 IC2.5
  Bottom 0.152: 16.05,14.88 16.05,16.56 v9.5,23.11 | v39.98,26.01 39.98,19.76 35.1,14.88 16.05,14.88 | 16.05,14.88 v16.05,14.73
PE3
  Top 0.152: IC1.5 29.46,25.86 29.46,39.73 30.38,40.64 J4.10
PE4
  Top 0.152: J4.9 29.16,39.42 29.16,31.34 28.85,31.04 28.85,25.86 IC1.6
PE5
  Top 0.152: IC1.7 28.4,25.86 28.4,29.67 26.42,31.65 26.42,39.73 25.5,40.64 J4.8
PG5
  Top 0.152: IC1.1 31.45,25.86 31.45,39.12 32.97,40.64 J4.11
PH3
  Top 0.152: IC1.15 24.43,25.86 24.43,39.12 22.91,40.64 J4.7
PH4
  Top 0.152: J4.6 23.98,36.98 23.98,25.86 IC1.16
PH5
  Top 0.152: IC1.17 23.37,25.86 23.37,27.99 18.19,33.17 18.19,40.34 17.88,40.64 J4.5
PH6  (via drill 0.35)
  Top 0.152: v21.23,29.21 22.91,27.53 22.91,25.86 IC1.18
  Bottom 0.152: v21.23,29.21 21.23,34.7 15.29,40.64 J4.4
RST
  Top 0.152: IC1.30 17.27,21.74 15.29,21.74 10.41,26.62 R6.1 10.41,26.77 11.33,27.69 11.33,32.56 11.18,32.72 9.8,32.72 8.89,33.63 8.89,34.7 7.67,35.92 7.67,36.83 C3.2 7.67,36.98 8.89,38.2 8.89,41.1 9.96,42.16 25.65,42.16 26.57,41.25 | RST.1 27.94,38.96 26.57,40.34 26.57,41.25 | 26.57,41.25 27.48,42.16 53.54,42.16 57.51,38.2 58.42,38.2 J1.5
RX0  (via drill 0.35)
  Top 0.152: v30.07,28.91 30.84,28.14 30.84,25.86 IC1.2
  Bottom 0.152: v30.07,28.91 21.84,28.91 21.39,28.45 17.73,28.45 9.5,36.68 4.93,36.68 J2.2
SCK  (via drill 0.35)
  Top 0.152: v21.84,27.53 21.84,25.86 IC1.20
  Bottom 0.152: v21.84,27.53 29.62,27.53 41.35,39.27 56.44,39.27 57.2,38.51 57.2,36.83 58.42,35.61 J1.3
TX0  (via drill 0.35)
  Top 0.152: v30.07,27.08 30.38,26.77 30.38,25.86 IC1.3
  Bottom 0.152: v30.07,27.08 22.3,27.08 22.15,26.92 18.8,26.92 9.35,36.37 7.21,36.37 3.86,33.02 J2.3
VCC
  Top 0.152: J4.16 J4.17 J4.18 J4.19 53.39,40.64 53.39,35.46 55.83,33.02 J1.2 55.98,33.02 55.98,24.49 | R3.2 10.11,31.95 7.67,31.95 R4.2 7.52,31.8 4.93,29.21 | 4.93,29.21 3.71,30.43 J2.4 | 4.93,29.21 7.37,26.77 R6.2 | 55.98,24.49 57.51,24.49 J3.1 | 55.98,24.49 45.31,24.49 41.2,20.37 38.15,20.37 IC2.8
  Bottom 0.152: J2.4 3.86,30.43 14.07,30.43 22.76,21.74 36.63,21.74 38,20.37 IC2.8
XTAL1
  Top 0.152: IC1.34 17.27,19.76 16.51,19.76 11.48,14.73 11.48,11.84 XTAL1.1 11.33,11.68 11.02,11.38 7.67,11.38 C1.1
XTAL2
  Top 0.152: IC1.33 17.27,20.37 12.24,20.37 11.48,21.13 XTAL1.2 11.33,21.29 11.02,21.59 7.67,21.59 C2.2